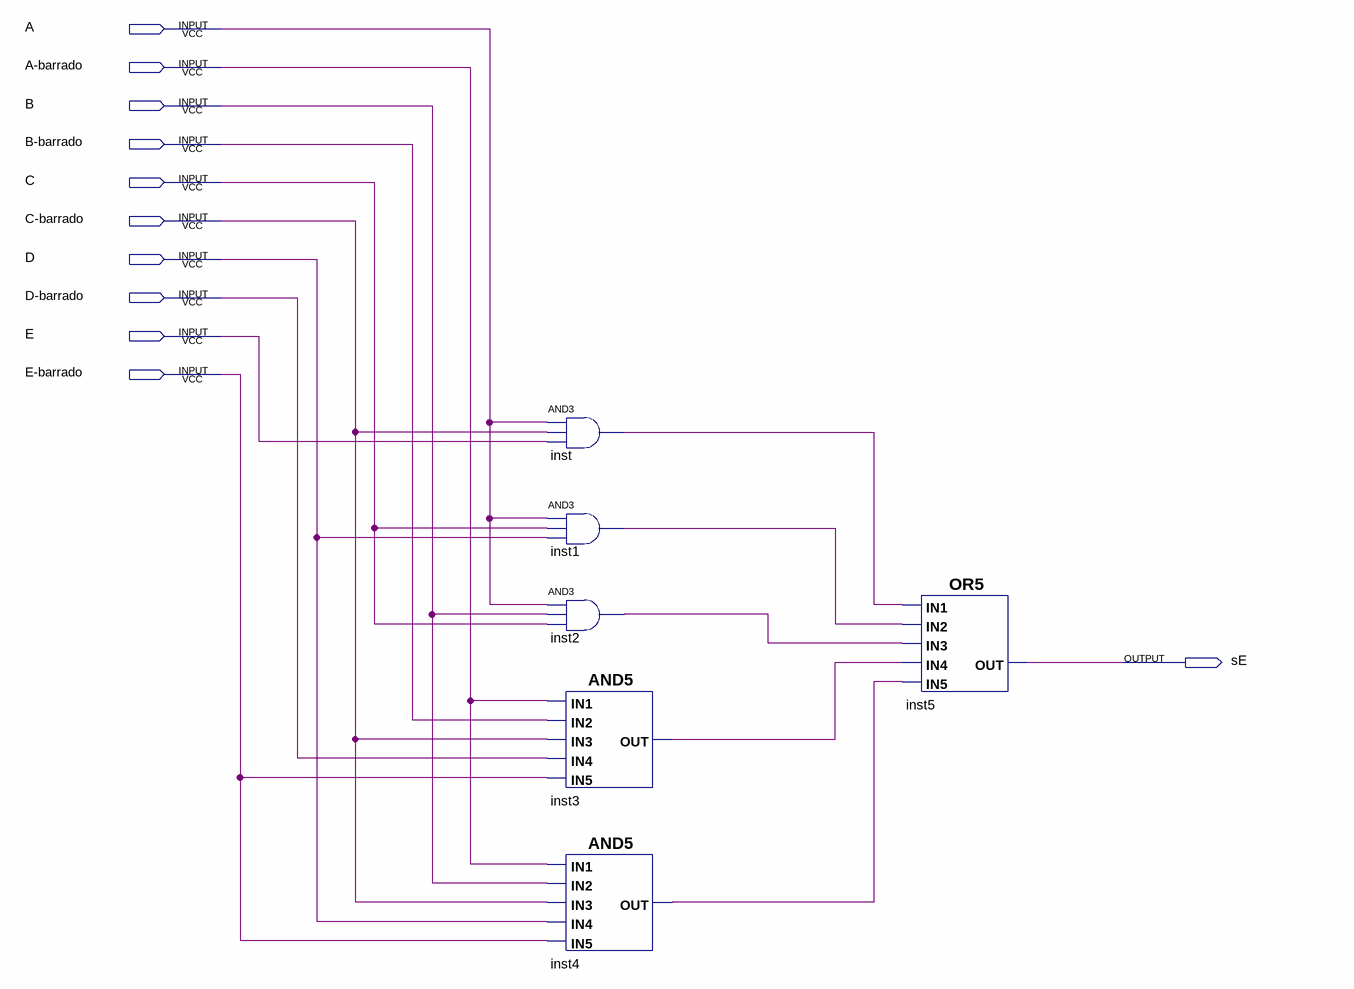
[diagram p0: schematic sheet]
// Quartus schematic saida_E.bdf as structural Verilog: 6 symbols, 11 pins
module saida_E (
  input  A,
  input  \A-barrado ,
  input  B,
  input  \B-barrado ,
  input  C,
  input  \C-barrado ,
  input  D,
  input  \D-barrado ,
  input  E,
  input  \E-barrado ,
  output sE
);

  wire inst1_out, inst2_out, inst3_out, inst4_out, inst_out;

  and inst (inst_out, A, \C-barrado , E);
  and inst1 (inst1_out, A, C, D);
  and inst2 (inst2_out, A, B, C);
  and inst3 (inst3_out, \A-barrado , \B-barrado , \C-barrado , \D-barrado , \E-barrado );
  and inst4 (inst4_out, \A-barrado , B, \C-barrado , D, \E-barrado );
  or inst5 (sE, inst_out, inst1_out, inst2_out, inst3_out, inst4_out);
endmodule
